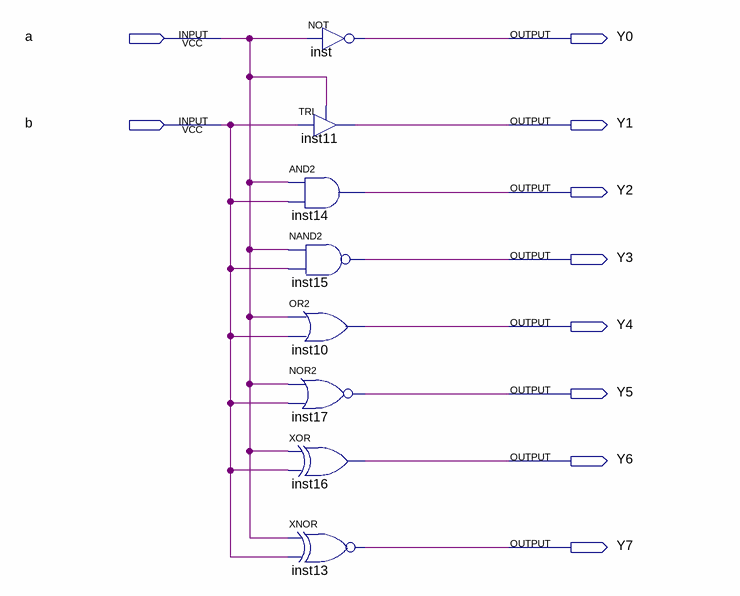
[diagram p0: schematic sheet]
// Quartus schematic 913018.bdf as structural Verilog: 8 symbols, 10 pins
module \913018  (
  input  a,
  input  b,
  output Y0,
  output Y1,
  output Y2,
  output Y3,
  output Y4,
  output Y5,
  output Y6,
  output Y7
);

  not inst (Y0, a);
  TRI inst11 (.IN(b), .OE(a), .OUT(Y1));
  and inst14 (Y2, a, b);
  nand inst15 (Y3, a, b);
  or inst10 (Y4, a, b);
  nor inst17 (Y5, a, b);
  xor inst16 (Y6, a, b);
  xnor inst13 (Y7, a, b);
endmodule
